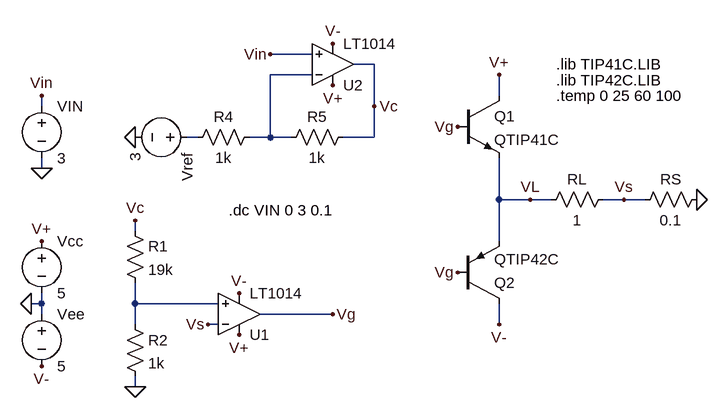
[diagram p0: schematic AmpOpDriverBipolarBJT_v4.asc]
AmpOpDriverBipolarBJT_v4.asc, the LTspice schematic file:
Version 4
SHEET 1 880 680
WIRE -128 -256 -192 -256
WIRE -32 -240 -64 -240
WIRE -128 -224 -192 -224
WIRE 160 -192 160 -224
WIRE -544 -176 -544 -192
WIRE -32 -176 -32 -240
WIRE -304 -128 -320 -128
WIRE -192 -128 -192 -224
WIRE -192 -128 -224 -128
WIRE -160 -128 -192 -128
WIRE -32 -128 -32 -176
WIRE -32 -128 -80 -128
WIRE -544 -80 -544 -96
WIRE 160 -32 160 -96
WIRE 208 -32 160 -32
WIRE 240 -32 208 -32
WIRE 352 -32 320 -32
WIRE 384 -32 352 -32
WIRE -400 16 -400 0
WIRE 160 32 160 -32
WIRE -544 128 -544 112
WIRE -544 128 -560 128
WIRE -400 128 -400 96
WIRE -272 128 -400 128
WIRE -544 144 -544 128
WIRE -96 144 -208 144
WIRE -400 160 -400 128
WIRE -272 160 -288 160
WIRE 160 160 160 128
WIRE -400 256 -400 240
FLAG 464 -32 0
FLAG 160 -224 V+
FLAG -96 144 Vg
FLAG 96 -144 Vg
FLAG -560 128 0
FLAG -544 32 V+
FLAG -240 176 V+
FLAG -544 224 V-
FLAG -544 -80 0
FLAG -240 112 V-
FLAG 160 160 V-
FLAG 208 -32 VL
FLAG 352 -32 Vs
FLAG 96 80 Vg
FLAG -288 160 Vs
FLAG -544 -192 Vin
FLAG -400 256 0
FLAG -400 0 Vc
FLAG -96 -208 V+
FLAG -96 -272 V-
FLAG -400 -128 0
FLAG -192 -256 Vin
FLAG -32 -176 Vc
SYMBOL res 224 -16 R270
WINDOW 0 32 56 VTop 2
WINDOW 3 0 56 VBottom 2
SYMATTR InstName RL
SYMATTR Value 1
SYMBOL res 368 -16 R270
WINDOW 0 32 56 VTop 2
WINDOW 3 0 56 VBottom 2
SYMATTR InstName RS
SYMATTR Value 0.1
SYMBOL OpAmps\\LT1014 -240 208 M180
SYMATTR InstName U1
SYMBOL voltage -544 -192 R0
WINDOW 123 0 0 Left 0
WINDOW 39 0 0 Left 0
SYMATTR InstName VIN
SYMATTR Value 3
SYMBOL voltage -544 16 R0
WINDOW 123 0 0 Left 0
WINDOW 39 0 0 Left 0
SYMATTR InstName Vcc
SYMATTR Value 5
SYMBOL voltage -544 128 R0
WINDOW 123 0 0 Left 0
WINDOW 39 0 0 Left 0
SYMATTR InstName Vee
SYMATTR Value 5
SYMBOL res -416 0 R0
SYMATTR InstName R1
SYMATTR Value 19k
SYMBOL res -416 144 R0
SYMATTR InstName R2
SYMATTR Value 1k
SYMBOL npn 96 -192 R0
SYMATTR InstName Q1
SYMATTR Value QTIP41C
SYMBOL pnp 96 128 M180
SYMATTR InstName Q2
SYMATTR Value QTIP42C
SYMBOL OpAmps\\LT1014 -96 -176 M180
SYMATTR InstName U2
SYMBOL voltage -304 -128 R90
WINDOW 123 0 0 Left 0
WINDOW 39 0 0 Left 0
SYMATTR InstName Vref
SYMATTR Value 3
SYMBOL res -208 -144 R90
WINDOW 0 0 56 VBottom 2
WINDOW 3 32 56 VTop 2
SYMATTR InstName R4
SYMATTR Value 1k
SYMBOL res -64 -144 R90
WINDOW 0 0 56 VBottom 2
WINDOW 3 32 56 VTop 2
SYMATTR InstName R5
SYMATTR Value 1k
TEXT -256 -16 Left 2 !.dc VIN 0 3 0.1
TEXT 248 -240 Left 2 !.lib TIP41C.LIB
TEXT 248 -216 Left 2 !.lib TIP42C.LIB
TEXT 248 -192 Left 2 !.temp 0 25 60 100

The netlist it stands for:
* AmpOpDriverBipolarBJT_v4.asc
RL VL Vs 1
RS Vs 0 0.1
XU1 N003 Vs V+ V- Vg LT1014  ; pins In+ In- V+ V- OUT
VIN Vin 0 3
Vcc V+ 0 5
Vee 0 V- 5
R1 Vc N003 19k
R2 N003 0 1k
Q1 V+ Vg VL 0 QTIP41C
Q2 V- Vg VL 0 QTIP42C
XU2 Vin N001 V+ V- Vc LT1014  ; pins In+ In- V+ V- OUT
Vref N002 0 3
R4 N001 N002 1k
R5 Vc N001 1k
.model NPN NPN
.model PNP PNP
.lib standard.bjt
.dc VIN 0 3 0.1
.lib TIP41C.LIB
.lib TIP42C.LIB
.temp 0 25 60 100
.backanno
.end